# Altium schematic sheet Sheet3.SchDoc
size A3; SheetNumber: 3; SheetTotal: 3
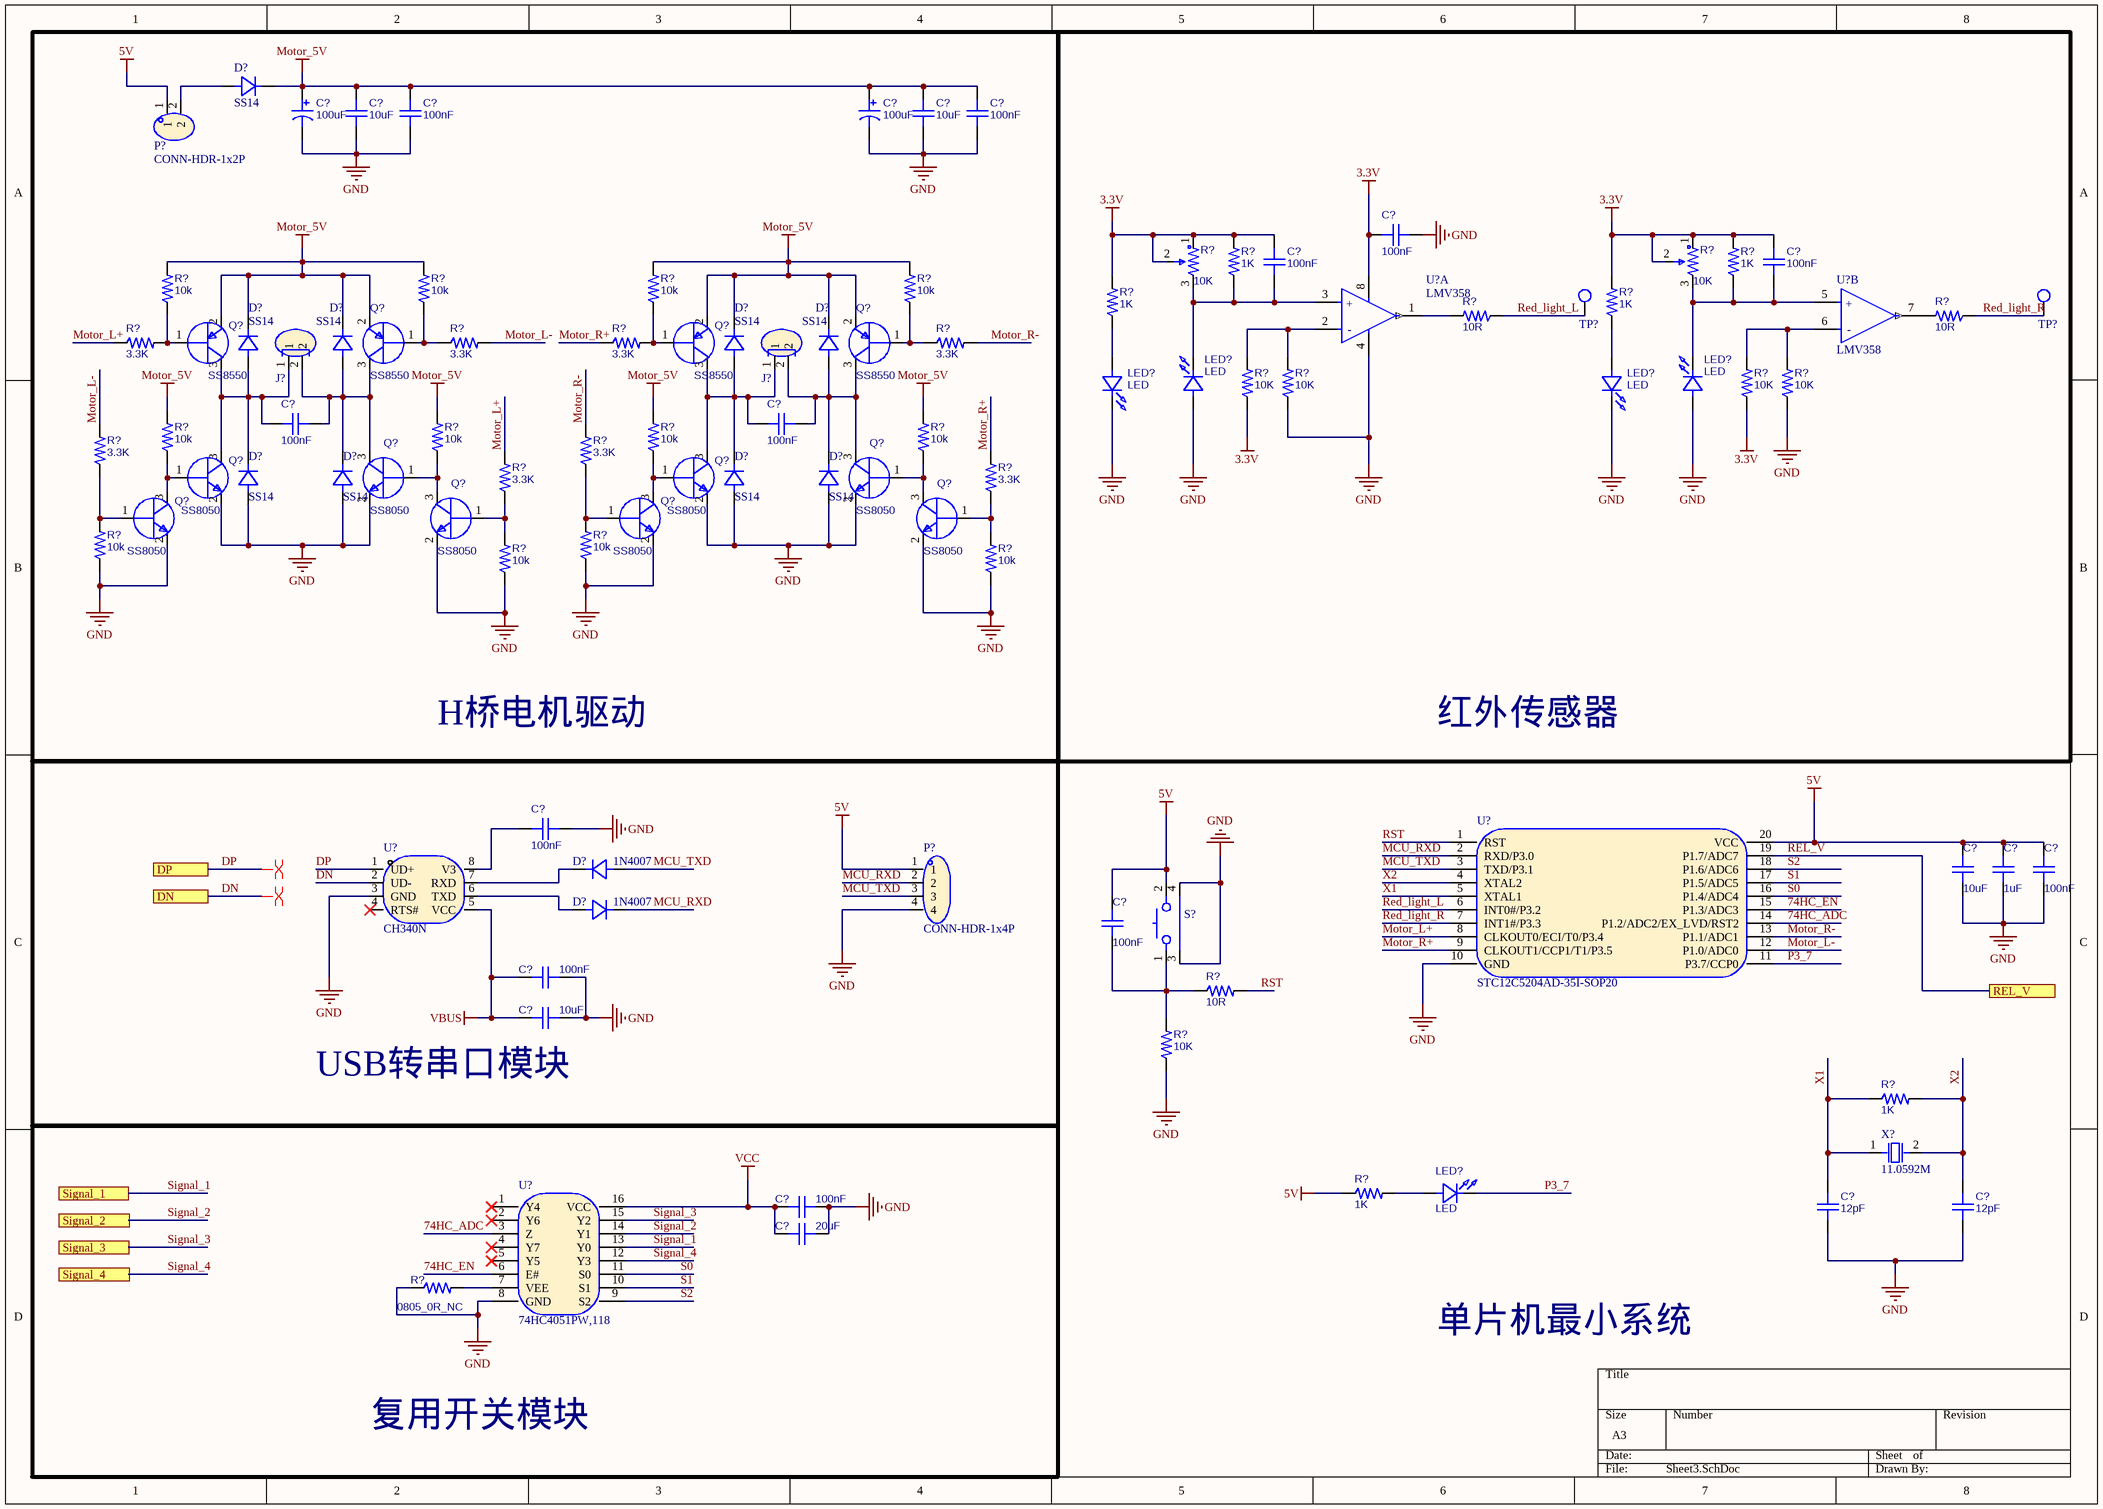
[diagram p0: Sheet3.SchDoc]

## Parts
(Parts that share a designator on the sheet are numbered #1, #2 ... from top to bottom, then left to right.)
C?#1  100uF  [CAPA-TH-5020-P2.0]
C?#2  10uF  [CAP-SMD-0603]
C?#3  100nF  [CAP-SMD-0603]
C?#4  100uF  [CAPA-TH-5020-P2.0]
C?#5  10uF  [CAP-SMD-0603]
C?#6  100nF  [CAP-SMD-0603]
C?#7  100nF  [CAP-SMD-0603]
C?#8  100nF  [CAP-SMD-0603]
C?#9  100nF  [CAP-SMD-0603]
C?#10  100nF  [CAP-SMD-0603]
C?#11  100nF  [CAP-SMD-0603]
C?#12  100nF  [CAP-SMD-0603]
C?#13  10uF  [CAP-SMD-0603]
C?#14  1uF  [CAP-SMD-0603]
C?#15  100nF  [CAP-SMD-0603]
C?#16  100nF  [CAP-SMD-0603]
C?#17  100nF  [CAP-SMD-0603]
C?#18  10uF  [CAP-SMD-0603]
C?#19  100nF  [CAP-SMD-0603]
C?#20  12pF  [CAP-SMD-0603]
C?#21  12pF  [CAP-SMD-0603]
C?#22  20uF  [CAP-SMD-0603]
D?#1  SS14  [SOD-123-P3.4]
D?#2  SS14  [SOD-123-P3.4]
D?#3  SS14  [SOD-123-P3.4]
D?#4  SS14  [SOD-123-P3.4]
D?#5  SS14  [SOD-123-P3.4]
D?#6  SS14  [SOD-123-P3.4]
D?#7  SS14  [SOD-123-P3.4]
D?#8  SS14  [SOD-123-P3.4]
D?#9  SS14  [SOD-123-P3.4]
D?#10  1N4007  [SOD-123-P3.4]
D?#11  1N4007  [SOD-123-P3.4]
J?#1  CONN-2P  [CONN-TH-CDS-1x2P-P2.54]  (value not drawn)
J?#2  CONN-2P  [CONN-TH-CDS-1x2P-P2.54]  (value not drawn)
LED?#1  LED  [LED-SMD-0805]
LED?#2  LED  [LED-SMD-0805]
LED?#3  LED  [LED-SMD-0805]
LED?#4  LED  [LED-SMD-0805]
LED?#5  LED  [LED-SMD-0805]
P?#1  CONN-HDR-1x2P  [CONN-TH-1X2P-P2.54]
P?#2  CONN-HDR-1x4P  [CONN-TH-1X4P-P2.54]
Q?#1  SS8550  [SOT-23-3-LP2.28-P1.91]
Q?#2  SS8550  [SOT-23-3-LP2.28-P1.91]
Q?#3  SS8550  [SOT-23-3-LP2.28-P1.91]
Q?#4  SS8550  [SOT-23-3-LP2.28-P1.91]
Q?#5  SS8050  [SOT-23-3-LP2.28-P1.91]
Q?#6  SS8050  [SOT-23-3-LP2.28-P1.91]
Q?#7  SS8050  [SOT-23-3-LP2.28-P1.91]
Q?#8  SS8050  [SOT-23-3-LP2.28-P1.91]
Q?#9  SS8050  [SOT-23-3-LP2.28-P1.91]
Q?#10  SS8050  [SOT-23-3-LP2.28-P1.91]
Q?#11  SS8050  [SOT-23-3-LP2.28-P1.91]
Q?#12  SS8050  [SOT-23-3-LP2.28-P1.91]
R?#1  10K  [RES-SMD-ADJ-3224W]
R?#2  1K  [RES-SMD-0603]
R?#3  10K  [RES-SMD-ADJ-3224W]
R?#4  1K  [RES-SMD-0603]
R?#5  10k  [RES-SMD-0603]
R?#6  10k  [RES-SMD-0603]
R?#7  10k  [RES-SMD-0603]
R?#8  10k  [RES-SMD-0603]
R?#9  1K  [RES-SMD-0603]
R?#10  1K  [RES-SMD-0603]
R?#11  10R  [RES-SMD-0603]
R?#12  10R  [RES-SMD-0603]
R?#13  3.3K  [RES-SMD-0603]
R?#14  3.3K  [RES-SMD-0603]
R?#15  3.3K  [RES-SMD-0603]
R?#16  3.3K  [RES-SMD-0603]
R?#17  10K  [RES-SMD-0603]
R?#18  10K  [RES-SMD-0603]
R?#19  10K  [RES-SMD-0603]
R?#20  10K  [RES-SMD-0603]
R?#21  10k  [RES-SMD-0603]
R?#22  10k  [RES-SMD-0603]
R?#23  10k  [RES-SMD-0603]
R?#24  10k  [RES-SMD-0603]
R?#25  3.3K  [RES-SMD-0603]
R?#26  3.3K  [RES-SMD-0603]
R?#27  3.3K  [RES-SMD-0603]
R?#28  3.3K  [RES-SMD-0603]
R?#29  10k  [RES-SMD-0603]
R?#30  10k  [RES-SMD-0603]
R?#31  10k  [RES-SMD-0603]
R?#32  10k  [RES-SMD-0603]
R?#33  10R  [RES-SMD-0603]
R?#34  10K  [RES-SMD-0603]
R?#35  1K  [RES-SMD-0603]
R?#36  1K  [RES-SMD-0603]
R?#37  0805_0R_NC  [RES-SMD-0603]
S?  KEY-B-2P  [KEY-TH-B-2P]  (value not drawn)
TP?#1  TP  [TP]  (value not drawn)
TP?#2  TP  [TP]  (value not drawn)
U?#1  LMV358  [SOIC-8-LP5.5-P1.27]  (part A of 2)
U?#2  LMV358  [SOIC-8-LP5.5-P1.27]  (part B of 2)
U?#3  CH340N  [SOP-8-LP5.3-P1.27]
U?#4  STC12C5204AD-35I-SOP20  [SOIC-20-LP9.5-P1.27]
U?#5  74HC4051PW,118  [TSSOP-16-LP5.7-P0.65]
X?  11.0592M  [OSC-5032-SMD-2P]

## Blocks framed on the sheet
H桥电机驱动: C?#1-C?#6 C?#10 C?#11 D?#1-D?#9 J?#1 J?#2 P?#1 Q?#1-Q?#12 R?#5-R?#8 R?#13-R?#16 R?#21-R?#32
红外传感器: C?#7-C?#9 LED?#1-LED?#4 R?#1-R?#4 R?#9-R?#12 R?#17-R?#20 TP?#1 TP?#2 U?#1 U?#2
USB转串口模块: C?#12 C?#17 C?#18 D?#10 D?#11 P?#2 U?#3
复用开关模块: C?#19 C?#22 R?#37 U?#5

## Ports
DN (see Sheet1[1A]), DP (see Sheet1[1A]), REL_V (see Sheet2[1B], Sheet2[1D], Sheet2[3B], Sheet2[3D]), Signal_1 (see Sheet2[2A]), Signal_2 (see Sheet2[4A]), Signal_3 (see Sheet2[2C]), Signal_4 (see Sheet2[4C])

## Nets
3.3V: C?#7.2 C?#8.2 C?#9.2 R?#1.1 R?#1.2 R?#2.2 R?#3.1 R?#3.2 R?#4.2 R?#9.2 R?#10.2 R?#17.1 R?#19.1 U?#1.8(VCC+)
5V: C?#13.2 C?#14.2 C?#15.2 C?#16.2 P?#1.1 P?#2.1 R?#36.1 S?.2 U?#4.20(VCC)
GND: C?#1.2 C?#2.1 C?#3.1 C?#4.2 C?#5.1 C?#6.1 C?#7.1 C?#12.2 C?#13.1 C?#14.1 C?#15.1 C?#17.2 C?#18.2 C?#19.2 C?#20.1 C?#21.1 C?#22.2 D?#6.1(K) D?#7.1(K) D?#8.1(K) D?#9.1(K) LED?#1.2(K) LED?#2.1(A) LED?#3.2(K) LED?#4.1(A) P?#2.4 Q?#5.2(E) Q?#6.2(E) Q?#7.2(E) Q?#8.2(E) Q?#9.2(E) Q?#10.2(E) Q?#11.2(E) Q?#12.2(E) R?#18.1 R?#20.1 R?#29.1 R?#30.1 R?#31.1 R?#32.1 R?#34.1 R?#37.1 S?.3 S?.4 U?#1.4(GND) U?#3.3(GND) U?#4.10(GND) U?#5.8(GND)
Motor_5V: C?#1.1 C?#2.2 C?#3.2 C?#4.1 C?#5.2 C?#6.2 D?#1.2(A) D?#2.2(A) D?#3.2(A) D?#4.2(A) D?#5.2(A) Q?#1.2(E) Q?#2.2(E) Q?#3.2(E) Q?#4.2(E) R?#5.2 R?#6.2 R?#7.2 R?#8.2 R?#21.2 R?#22.2 R?#23.2 R?#24.2
VBUS: C?#17.1 C?#18.1 U?#3.5(VCC)
VCC: C?#19.1 C?#22.1 U?#5.16(VCC)
74HC_ADC: U?#4.14(P1.2/ADC2/EX_LVD/RST2) U?#5.3(Z)
74HC_EN: U?#4.15(P1.3/ADC3) U?#5.6(E#)
DN: U?#3.2(UD-) ; port DN
DP: U?#3.1(UD+) ; port DP
MCU_RXD: D?#11.2(A) P?#2.2 U?#4.2(RXD/P3.0)
MCU_TXD: D?#10.1(K) P?#2.3 U?#4.3(TXD/P3.1)
Motor_L+: R?#13.1 R?#27.2 U?#4.8(CLKOUT0/ECI/T0/P3.4)
Motor_L-: R?#14.2 R?#25.2 U?#4.12(P1.0/ADC0)
Motor_R+: R?#15.1 R?#28.2 U?#4.9(CLKOUT1/CCP1/T1/P3.5)
Motor_R-: R?#16.2 R?#26.2 U?#4.13(P1.1/ADC1)
P3_7: LED?#5.2(K) U?#4.11(P3.7/CCP0)
Red_light_L: R?#11.1 TP?#1.1 U?#4.6(INT0#/P3.2)
Red_light_R: R?#12.1 TP?#2.1 U?#4.7(INT1#/P3.3)
REL_V: U?#4.19(P1.7/ADC7) ; port REL_V
RST: R?#33.2 U?#4.1(RST)
S0: U?#4.16(P1.4/ADC4) U?#5.11(S0)
S1: U?#4.17(P1.5/ADC5) U?#5.10(S1)
S2: U?#4.18(P1.6/ADC6) U?#5.9(S2)
Signal_1: U?#5.13(Y0) ; port Signal_1
Signal_2: U?#5.14(Y1) ; port Signal_2
Signal_3: U?#5.15(Y2) ; port Signal_3
Signal_4: U?#5.12(Y3) ; port Signal_4
X1: C?#20.2 R?#35.1 U?#4.5(XTAL1) X?.1(OSC1)
X2: C?#21.2 R?#35.2 U?#4.4(XTAL2) X?.2(OSC2)
NetC?#8_1: C?#8.1 LED?#2.2(K) R?#1.3 R?#2.1 U?#1.3(1IN+)
NetC?#9_1: C?#9.1 LED?#4.2(K) R?#3.3 R?#4.1 U?#2.5(1IN+)
NetC?#10_1: C?#10.1 D?#2.1(K) D?#6.2(A) J?#1.1 Q?#1.3(C) Q?#5.3(C)
NetC?#10_2: C?#10.2 D?#3.1(K) D?#7.2(A) J?#1.2 Q?#2.3(C) Q?#6.3(C)
NetC?#11_1: C?#11.1 D?#4.1(K) D?#8.2(A) J?#2.1 Q?#3.3(C) Q?#7.3(C)
NetC?#11_2: C?#11.2 D?#5.1(K) D?#9.2(A) J?#2.2 Q?#4.3(C) Q?#8.3(C)
NetC?#12_1: C?#12.1 U?#3.8(V3)
NetC?#16_1: C?#16.1 R?#33.1 R?#34.2 S?.1
NetD?#1_1: D?#1.1(K) P?#1.2
NetD?#10_2: D?#10.2(A) U?#3.7(RXD)
NetD?#11_1: D?#11.1(K) U?#3.6(TXD)
NetLED?#1_1: LED?#1.1(A) R?#9.1
NetLED?#3_1: LED?#3.1(A) R?#10.1
NetLED?#5_1: LED?#5.1(A) R?#36.2
NetQ?#1_1: Q?#1.1(B) R?#5.1 R?#13.2
NetQ?#2_1: Q?#2.1(B) R?#6.1 R?#14.1
NetQ?#3_1: Q?#3.1(B) R?#7.1 R?#15.2
NetQ?#4_1: Q?#4.1(B) R?#8.1 R?#16.1
NetQ?#5_1: Q?#5.1(B) Q?#9.3(C) R?#21.1
NetQ?#6_1: Q?#6.1(B) Q?#10.3(C) R?#22.1
NetQ?#7_1: Q?#7.1(B) Q?#11.3(C) R?#23.1
NetQ?#8_1: Q?#8.1(B) Q?#12.3(C) R?#24.1
NetQ?#9_1: Q?#9.1(B) R?#25.1 R?#29.2
NetQ?#10_1: Q?#10.1(B) R?#27.1 R?#31.2
NetQ?#11_1: Q?#11.1(B) R?#26.1 R?#30.2
NetQ?#12_1: Q?#12.1(B) R?#28.1 R?#32.2
NetR?#11_2: R?#11.2 U?#1.1(OUT)
NetR?#12_2: R?#12.2 U?#2.7(OUT)
NetR?#17_2: R?#17.2 R?#18.2 U?#1.2(1IN-)
NetR?#19_2: R?#19.2 R?#20.2 U?#2.6(1IN-)
NetR?#37_2: R?#37.2 U?#5.7(VEE)

Not connected (* = marked no-connect by the designer): U?#3 4(RTS#)*; U?#5 1(Y4)* 2(Y6)* 4(Y7)* 5(Y5)*

## Layout directives
differential pair: DN, DP

## Notes on the sheet
- 单片机最小系统
- (in symbol LMV358, part A) +; -
- (in symbol LMV358, part B) +; -

## Library data of the parts
C?#1 C?#4 = CAPA: 电解电容; BOM_Manufacturer: ValuePro; BOM_Manufacturer Part: 普通黑色470UF 50V; nameAlias: Capacitance; BOM_Supplier: LCSC; BOM_Supplier Part: C34642; BOM_JLCPCB Part Class: Extended Part; spicePre: C; spiceSymbolName: 470UF 50V
C?#2 C?#3 C?#5-C?#22 = CAP: 贴片电容; BOM_Manufacturer: SAMSUNG; BOM_Manufacturer Part: CL03A104KQ3NNNC; nameAlias: Capacitance; Contributor: LCSC; BOM_Supplier: LCSC; BOM_Supplier Part: C160831; BOM_JLCPCB Part Class: Extended Part; spicePre: C; spiceSymbolName: CL03A104KQ3NNNC
D?#1-D?#11 = Diode: 二极管1N4148W; Manufacturer: PSI(宝力芯); Symbol: 1N4148W_C2840890; Add into BOM: yes; Power Dissipation: 350mW; Reverse Voltage (Vr): 100V; Average Rectified Current (Io): 150mA; Forward Voltage (Vf@If): 1.25V@150mA; Reverse Leakage Current: 1A@75V; Reverse Recovery Time (trr): 4ns; Device: 1N4148W; LCSC Part Name: 100V 150mA 4ns; Supplier Part: C2840890; Manufacturer Part: 1N4148W; Supplier Footprint: SOD-123; JLCPCB Part Class: Extended Part; Datasheet: https://atta.szlcsc.com/upload/public/pdf/source/20210709/C2840890_3AF002B6505A4091F26B54E36362ABEF.pdf; Supplier: LCSC; Convert to PCB: yes; Diode Configuration: -; Operating Temperature: +150@(Tj)
J?#1 J?#2 = CONN-2P: 连接插座2pin; Manufacturer: KEFA(科发); Symbol: KF301-5.0-2P; Add into BOM: yes; Pitch: 5mm; Number of PINs Per Row: 2; Current Rating (Max): 17A; Voltage Rating (Max): 250V; Wire Gauge - AWG: 14~22; Wire Gauge - mm?: 1.5; Device: KF301-5.0-2P; LCSC Part Name: 5mm 排数:1 每排P数:2 直针 可拼接 铜 环保; Supplier Part: C474881; Manufacturer Part: KF301-5.0-2P; Supplier Footprint: P=5mm; JLCPCB Part Class: Extended Part; Datasheet: https://atta.szlcsc.com/upload/public/pdf/source/20200115/C474881_883EFE2003339C40FD1BEEEFC9A18423.pdf; Supplier: LCSC; Convert to PCB: yes; Number of Rows: 1; Mounting Style: 直针; Operating Temperature Range: -30~+120; Color: 蓝色
LED?#1-LED?#5 = LED: LED灯,发光二极管; BOM_Manufacturer: yongyu(永裕光电); BOM_Manufacturer Part: SZYY0402B; Contributor: LCSC; BOM_Supplier: LCSC; BOM_Supplier Part: C434447; spicePre: L; spiceSymbolName: SZYY0402B
P?#1 = CONN-HDR-1x2P: 排针1*2pin; Manufacturer: kinghelm(金航标); Symbol: KH-2.54PH180-1X2P-L11.5; Add into BOM: yes; Pitch: 2.54mm; Pin Structure: 1x2P; Circluar Pins/Square Pins: 方针; Current Rating (Max): 3A; Device: KH-2.54PH180-1X2P-L11.5; LCSC Part Name: 2.54mm 1x2P; Supplier Part: C2905434; Manufacturer Part: KH-2.54PH180-1X2P-L11.5; Supplier Footprint: 插件,P=2.54mm; JLCPCB Part Class: Extended Part; Datasheet: https://atta.szlcsc.com/upload/public/pdf/source/20211019/75EAF9E0823F75B5BB441C07BAE9F5E6.pdf; Supplier: LCSC; Convert to PCB: yes; Number of Pins: 2; Number of Rows: 1; Row Spacing: -; Mounting Type: 直插; Voltage Rating (Max): -; Length of Mating Pin: 6mm; Insulation Height: 2.5mm; Length of End Connection Pin: 3mm; Contact Material: -; Operating Temperature Range: -40~+105; Color: 黑色
P?#2 = CONN-HDR-1x4P: 排针1*4pin; Manufacturer: Wcon(维峰电子); Symbol: 1125-1104G0S116C001; Add into BOM: yes; Pitch: 2.54mm; Pin Structure: 1x4P; Circluar Pins/Square Pins: 方针; Current Rating (Max): 3A; Voltage Rating (Max): 320V; Device: 1125-1104G0S116C001; LCSC Part Name: 2.54mm 1x4P; Supplier Part: C920779; Manufacturer Part: 1125-1104G0S116C001; Supplier Footprint: 插件,P=2.54mm; JLCPCB Part Class: Extended Part; Datasheet: https://atta.szlcsc.com/upload/public/pdf/source/20210514/C920781_63E6ED3EFA6284A9B57E07350A5F58E4.pdf; Supplier: LCSC; Convert to PCB: yes; Number of Pins: 4; Number of Rows: 1; Row Spacing: 2.54mm; Mounting Type: 直插; Length of Mating Pin: 6.1mm; Insulation Height: 2.5mm; Length of End Connection Pin: 3mm; Contact Material: 黄铜; Contact Plating: 金; Operating Temperature Range: -40~+105; Color: 黑色
Q?#1-Q?#4 = PNP-SOT-23-3: 贴片PNP三极管; BOM_Manufacturer: YONGYUTAI(永裕泰); BOM_Manufacturer Part: S9012; Contributor: LCSC; BOM_Supplier: LCSC; BOM_Supplier Part: C2891799; BOM_JLCPCB Part Class: Extended Part; spicePre: Q; spiceSymbolName: S9012_C2891799
Q?#5-Q?#12 = NPN-SOT-23-3: 贴片NPN三极管; BOM_Manufacturer: YFW佑风微; BOM_Manufacturer Part: S9013; Contributor: LCSC; BOM_Supplier: LCSC; BOM_Supplier Part: C2898668; BOM_JLCPCB Part Class: Extended Part; spicePre: Q; spiceSymbolName: S9013_C2898668
R?#1 R?#3 = RES-ADJ: 可调电阻,电位器; BOM_Manufacturer: Chengdu Guosheng Tech; BOM_Manufacturer Part: 3362P-1-104; Resistance(Ohms): 100K; nameAlias: Resistance; Contributor: LCSC; BOM_Supplier: LCSC; BOM_Supplier Part: C118966; Resistance (Ohms): 100K; BOM_JLCPCB Part Class: Extended Part; spicePre: R; spiceSymbolName: 3362P-1-104_C118966
R?#2 R?#4-R?#37 = RES: 贴片电阻; BOM_Manufacturer: Chengdu Guosheng Tech; BOM_Manufacturer Part: 3362P-1-104; Resistance(Ohms): 100K; nameAlias: Resistance; Contributor: LCSC; BOM_Supplier: LCSC; BOM_Supplier Part: C118966; Resistance (Ohms): 100K; BOM_JLCPCB Part Class: Extended Part; spicePre: R; spiceSymbolName: 3362P-1-104_C118966
S? = KEY-B-2P: 按键开关B; Manufacturer: C&K; Symbol: PTS645VL83LFS; Add into BOM: yes; Device: PTS645VL83LFS; LCSC Part Name: 轻触开关; Supplier Part: C918856; Manufacturer Part: PTS645VL83LFS; Supplier Footprint: 插件; JLCPCB Part Class: Extended Part; Datasheet: https://atta.szlcsc.com/upload/public/pdf/source/20200930/C879394_D7DA174BB86F37E4F50AF53F8B4AE402.pdf; Supplier: LCSC; Convert to PCB: yes
TP?#1 TP?#2 = TP: TP测试点
U?#1 U?#2 = LMV358: 运放IC OPAMP GP 2 CIRCUIT 8SOIC
U?#3 = CH340N: Manufacturer: WCH(南京沁恒); Symbol: CH340N_C2977777; Add into BOM: yes; Name: CH340N; Device: CH340N; LCSC Part Name: CH340N; Supplier Part: C2977777; Manufacturer Part: CH340N; Supplier Footprint: SOP-8; JLCPCB Part Class: 扩展库; Datasheet: https://atta.szlcsc.com/upload/public/pdf/source/20220223/82A45E4FF89B3EDCAD50B354450A7EF4.pdf; Supplier: LCSC; Convert to PCB: yes
U?#4 = STC12C5204AD-35I-SOP20: CPU内核:51系列;CPU最大主频:35MHz;工作电压范围:4V~5.5V;内部振荡器:有;外部时钟频率范围:-;程序 FLASH容量:4KB;RAM总容量:256Byte;EEPROM/数据 FLASH容量:1KB;GPIO端口数量:15;ADC(单元数/通道数/位数):1@x8ch/8bit;DAC(单元数/通道数/位数):-;(E)PWM(单元数/通道数/位数):-;8位Timer数量:-;16位Timer数量:2;32位Timer数量:-;内部比较器数量:-;U(S)ART路数:1;I2C路数; Manufacturer: STC(宏晶); Add into BOM: yes; CPU Core: 51系列; Maximum Frequency: 35MHz; Internal Oscillator: 有; Program FLASH Size: 4KB; EEPROM/Data FLASH Size: 1KB; GPIO Ports Number: 15; 16Bit Timer Number: 2; U(S)ART Number: 1; Peripherals / Functions / Protocol Stacks: 低电压检测；看门狗；CCP捕获/比较; Name: STC12C5204AD-35I-SOP20; Symbol: STC12C5204AD-35I; Device: STC12C5204AD-35I-SOP20; LCSC Part Name: STC12C5204AD-35I-SOP20; Supplier Part: C8703; Manufacturer Part: STC12C5204AD-35I-SOP20; Supplier Footprint: SOIC-20_300mil; JLCPCB Part Class: 扩展库; Datasheet: https://atta.szlcsc.com/upload/public/pdf/source/20120808/1457706523764.pdf; Supplier: LCSC; Convert to PCB: yes; Supply Voltage Range: 4V~5.5V; External Clock Frequency Rang: -; RAM Size: 256Byte; ADC (Units/Channels/bits): 1@x8ch/8bit; DAC (Units/Channels/bits): -; (E)PWM (Units/Channels/bits): -; 8Bit Timer Number: -; 32Bit Timer Number: -; CMP Number: -; I2C Number: -; I2S Number: -; (Q)SPI Number: -; CAN Number: -; USB (H/D/OTG): -; Operating Temperature Range: -40~+85
U?#5 = 74HC4051PW,118: 复用开关IC MUX/DEMUX 8X1; Manufacturer: Nexperia(安世); Add into BOM: yes; Name: 74HC4051PW,118; Symbol: 74HC4051PW,118; Device: 74HC4051PW,118; LCSC Part Name: 74HC4051PW,118; Supplier Part: C5645; Manufacturer Part: 74HC4051PW,118; Supplier Footprint: TSSOP-16; JLCPCB Part Class: 扩展库; Datasheet: https://atta.szlcsc.com/upload/public/pdf/source/20120413/1457706470089.pdf; Supplier: LCSC; Convert to PCB: yes
X? = XTAL-2P-WY: 无源晶振2pin; Manufacturer: YXC扬兴科技; Symbol: X49SM16MSD2SI; Add into BOM: yes; Crystal Type: 49SMD; Frequency Tolerance: ±20ppm; Frequency Stability: ±30ppm; Load Capacitance: 20pF; Equivalent Series Resistance (ESR): 40Ω; Device: X49SM16MSD2SI; LCSC Part Name: 16MHz ±20ppm 20pF; Supplier Part: C90678; Manufacturer Part: X49SM16MSD2SI; Supplier Footprint: HC-49S/SMD; JLCPCB Part Class: Extended Part; Datasheet: https://atta.szlcsc.com/upload/public/pdf/source/20210329/C106809_0E91E60850A780B284B63D653DC40EA4.pdf; Supplier: LCSC; Convert to PCB: yes; Operating Temperature: -40~+85